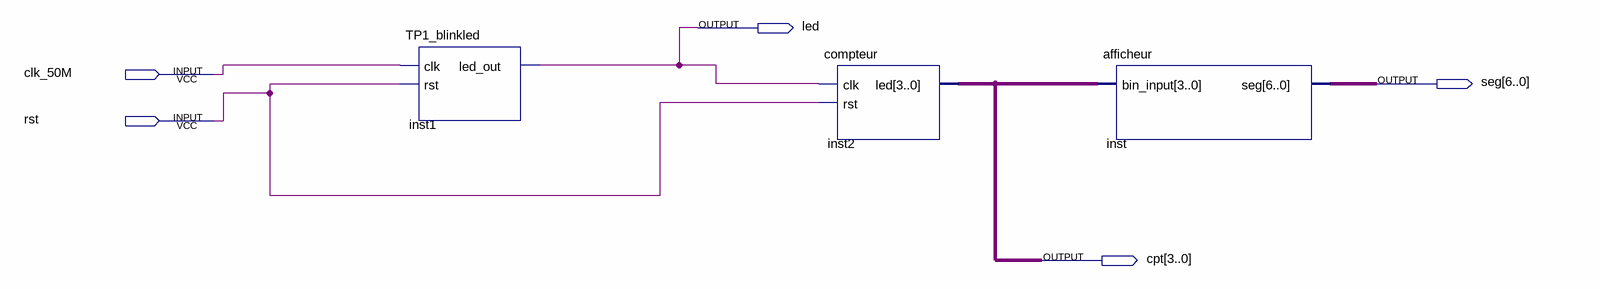
[diagram p0: schematic sheet]
// Quartus schematic projet_complet.bdf as structural Verilog: 3 symbols, 5 pins
module projet_complet (
  input  clk_50M,
  input  rst,
  output led,
  output [6:0] seg,
  output [3:0] cpt
);

  TP1_blinkled inst1 (.clk(clk_50M), .rst(rst), .led_out(led));
  compteur inst2 (.clk(led), .rst(rst), .led(cpt));
  afficheur inst (.bin_input(cpt), .seg(seg));
endmodule
